# EAGLE design DCC zDecoder (EAGLE 9.6.2)
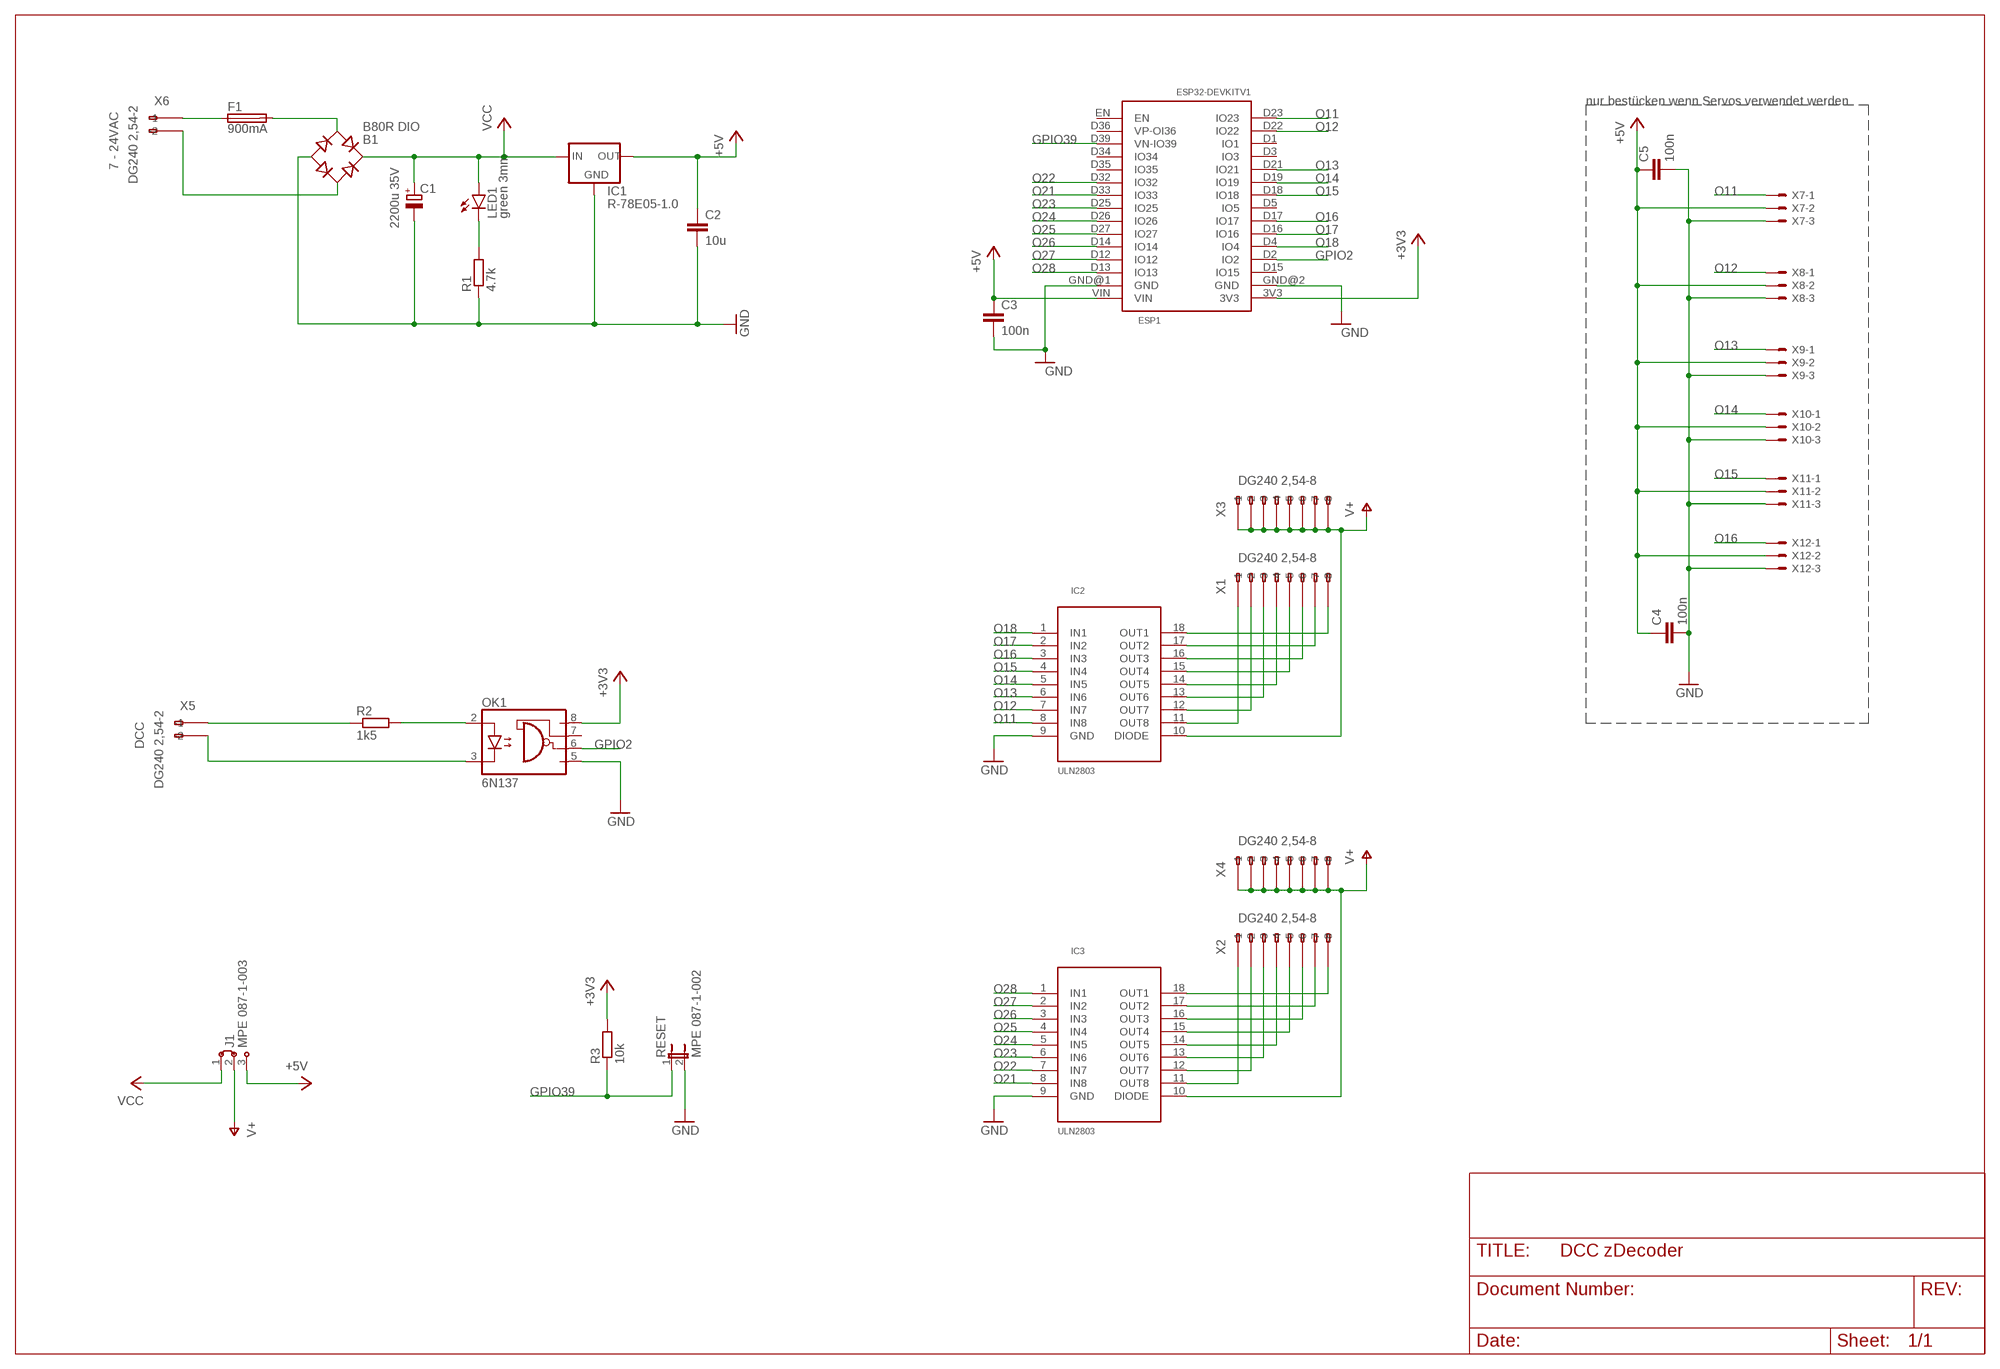
[diagram p0: schematic, sheet 1]

## Parts
B1  B80R DIO  RB1A  [RB1A]
C1  2200u 35V  CPOL-EUE5-8.5  [E5-8,5]
C2  10u  C-EU050-024X044  [C050-024X044]
C3  100n  C-EU050-024X044  [C050-024X044]
C4  100n  C-EU050-024X044  [C050-024X044]
C5  100n  C-EU050-024X044  [C050-024X044]
ESP1  ESP32DEVKITV1  [ESP32-DEVKITV1]
F1  900mA  TE5  [TE5]
IC1  R-78E05-1.0  R-78E-XX1.0  [R-78E-XX1.0]
IC2  ULN2803  ULN2803DIL18  [DIL18]
IC3  ULN2803  ULN2803DIL18  [DIL18]
J1  MPE 087-1-003  J2X2MM  [04C]
LED1  green 3mm  TLLG4400  [LED3MM]
OK1  6N137  [DIL08]
R1  4.7k  R-EU_0207/10  [0207/10]
R2  1k5  R-EU_0207/10  [0207/10]
R3  10k  R-EU_0207/10  [0207/10]
RESET  MPE 087-1-002  JP1E  [JP1]
X1  DG240 2,54-8  233-508  [233-508]
X2  DG240 2,54-8  233-508  [233-508]
X3  DG240 2,54-8  233-508  [233-508]
X4  DG240 2,54-8  233-508  [233-508]
X5  DG240 2,54-2  233-202  [233-202]
X6  DG240 2,54-2  233-202  [233-202]
X7  PSS 254/3G  22-23-2031  [22-23-2031]
X8  PSS 254/3G  22-23-2031  [22-23-2031]
X9  PSS 254/3G  22-23-2031  [22-23-2031]
X10  PSS 254/3G  22-23-2031  [22-23-2031]
X11  PSS 254/3G  22-23-2031  [22-23-2031]
X12  PSS 254/3G  22-23-2031  [22-23-2031]

## Nets
+3V3: ESP1.3V3 OK1.8(VCC) R3.2
+5V: C2.1 C3.1 C4.1 C5.1 ESP1.VIN IC1.OUT J1.3 X7.2 X8.2 X9.2 X10.2 X11.2 X12.2
GND: B1.- C1.- C2.2 C3.2 C4.2 C5.2 ESP1.GND@1(GND) ESP1.GND@2(GND) IC1.GND IC2.9(GND) IC3.9(GND) OK1.5(GND) R1.1 RESET.2 X7.3 X8.3 X9.3 X10.3 X11.3 X12.3
GPIO2: ESP1.D2(IO2) OK1.6(VO)
GPIO39: ESP1.D39(VN-IO39) R3.1 RESET.1
N$1: IC2.11(OUT8) X1.A1(-1)
N$2: IC2.12(OUT7) X1.A2(-2)
N$3: LED1.K(C) R1.2
N$4: IC2.13(OUT6) X1.A3(-3)
N$5: B1.AC1 F1.2
N$6: B1.AC2 X6.A2(-2)
N$7: IC2.14(OUT5) X1.A4(-4)
N$8: IC2.15(OUT4) X1.A5(-5)
N$9: R2.1 X5.A1(-1)
N$10: OK1.2(A) R2.2
N$11: OK1.3(C) X5.A2(-2)
N$12: IC2.16(OUT3) X1.A6(-6)
N$13: IC2.17(OUT2) X1.A7(-7)
N$14: IC2.18(OUT1) X1.A8(-8)
N$15: F1.1 X6.A1(-1)
N$16: IC3.18(OUT1) X2.A8(-8)
N$17: IC3.17(OUT2) X2.A7(-7)
N$18: IC3.16(OUT3) X2.A6(-6)
N$19: IC3.15(OUT4) X2.A5(-5)
N$20: IC3.14(OUT5) X2.A4(-4)
N$21: IC3.13(OUT6) X2.A3(-3)
N$22: IC3.12(OUT7) X2.A2(-2)
N$23: IC3.11(OUT8) X2.A1(-1)
O11: ESP1.D23(IO23) IC2.8(IN8) X7.1
O12: ESP1.D22(IO22) IC2.7(IN7) X8.1
O13: ESP1.D21(IO21) IC2.6(IN6) X9.1
O14: ESP1.D19(IO19) IC2.5(IN5) X10.1
O15: ESP1.D18(IO18) IC2.4(IN4) X11.1
O16: ESP1.D17(IO17) IC2.3(IN3) X12.1
O17: ESP1.D16(IO16) IC2.2(IN2)
O18: ESP1.D4(IO4) IC2.1(IN1)
O21: ESP1.D33(IO33) IC3.8(IN8)
O22: ESP1.D32(IO32) IC3.7(IN7)
O23: ESP1.D25(IO25) IC3.6(IN6)
O24: ESP1.D26(IO26) IC3.5(IN5)
O25: ESP1.D27(IO27) IC3.4(IN4)
O26: ESP1.D14(IO14) IC3.3(IN3)
O27: ESP1.D12(IO12) IC3.2(IN2)
O28: ESP1.D13(IO13) IC3.1(IN1)
V+: IC2.10(DIODE) IC3.10(DIODE) J1.2 X3.A1(-1) X3.A2(-2) X3.A3(-3) X3.A4(-4) X3.A5(-5) X3.A6(-6) X3.A7(-7) X3.A8(-8) X4.A1(-1) X4.A2(-2) X4.A3(-3) X4.A4(-4) X4.A5(-5) X4.A6(-6) X4.A7(-7) X4.A8(-8)
VCC: B1.+ C1.+ IC1.IN J1.1 LED1.A
Unconnected: ESP1.D1(IO1) ESP1.D3(IO3) ESP1.D5(IO5) ESP1.D15(IO15) ESP1.D34(IO34) ESP1.D35(IO35) ESP1.D36(VP-OI36) ESP1.EN OK1.7(VE) X1.B1(B-1) X1.B2(B-2) X1.B3(B-3) X1.B4(B-4) X1.B5(B-5) X1.B6(B-6) X1.B7(B-7) X1.B8(B-8) X2.B1(B-1) X2.B2(B-2) X2.B3(B-3) X2.B4(B-4) X2.B5(B-5) X2.B6(B-6) X2.B7(B-7) X2.B8(B-8) X3.B1(B-1) X3.B2(B-2) X3.B3(B-3) X3.B4(B-4) X3.B5(B-5) X3.B6(B-6) X3.B7(B-7) X3.B8(B-8) X4.B1(B-1) X4.B2(B-2) X4.B3(B-3) X4.B4(B-4) X4.B5(B-5) X4.B6(B-6) X4.B7(B-7) X4.B8(B-8) X5.B1(B-1) X5.B2(B-2) X6.B1(B-1) X6.B2(B-2)

## Notes on the sheet
- nur bestücken wenn Servos verwendet werden
- 7 - 24VAC
- DCC

## Library data of the parts
B1 = rectifier:RB1A: RECTIFIER 1 A
C1 = rcl:CPOL-EU: POLARIZED CAPACITOR, European symbol; SPICEPREFIX: C
C2-C5 = rcl:C-EU: CAPACITOR, European symbol; SPICEPREFIX: C
ESP1 = _esp32:ESP32DEVKITV1
F1 = fuse:TE5: FUSE Wickmann; OC_FARNELL: unknown; OC_NEWARK: unknown
IC1 = _eigene:R-78E-XX1.0: VOLTAGE REGULATOR
IC2 IC3 = _eigene:ULN2803
J1 = jumper:J2: Jumper switch 2 x 2.5 mm
LED1 = led:TLLG4400: Low Current (2mA) LED 3 mm Tinted Diffused Package color GREEN Source: Data sheet <http://www.farnell.com/datasheets/391098.pdf>; MF: VISHAY SEMICONDUCTOR; OC_FARNELL: 1612435
OK1 = optocoupler:6N137: MOTOROLA OPTO COUPLER; MPN: 6N137; OC_FARNELL: 1328376; OC_NEWARK: 52M1895
R1-R3 = rcl:R-EU_: RESISTOR, European symbol; SPICEPREFIX: R
RESET = jumper:JP1E: JUMPER
X1-X4 = con-wago255:233-508: WAGO; MF: Wago Corporation; MPN: 0233-0508; OC_FARNELL: 1777101; OC_NEWARK: 79K2053
X5 X6 = con-wago255:233-202: WAGO; MPN: 233-202; OC_FARNELL: 1283532; OC_NEWARK: 28K9059
X7-X12 = con-molex:22-23-2031: .100" (2.54mm) Center Header - 3 Pin; MF: MOLEX; MPN: 22-23-2031; OC_FARNELL: 1462950; OC_NEWARK: 30C0862

## Board
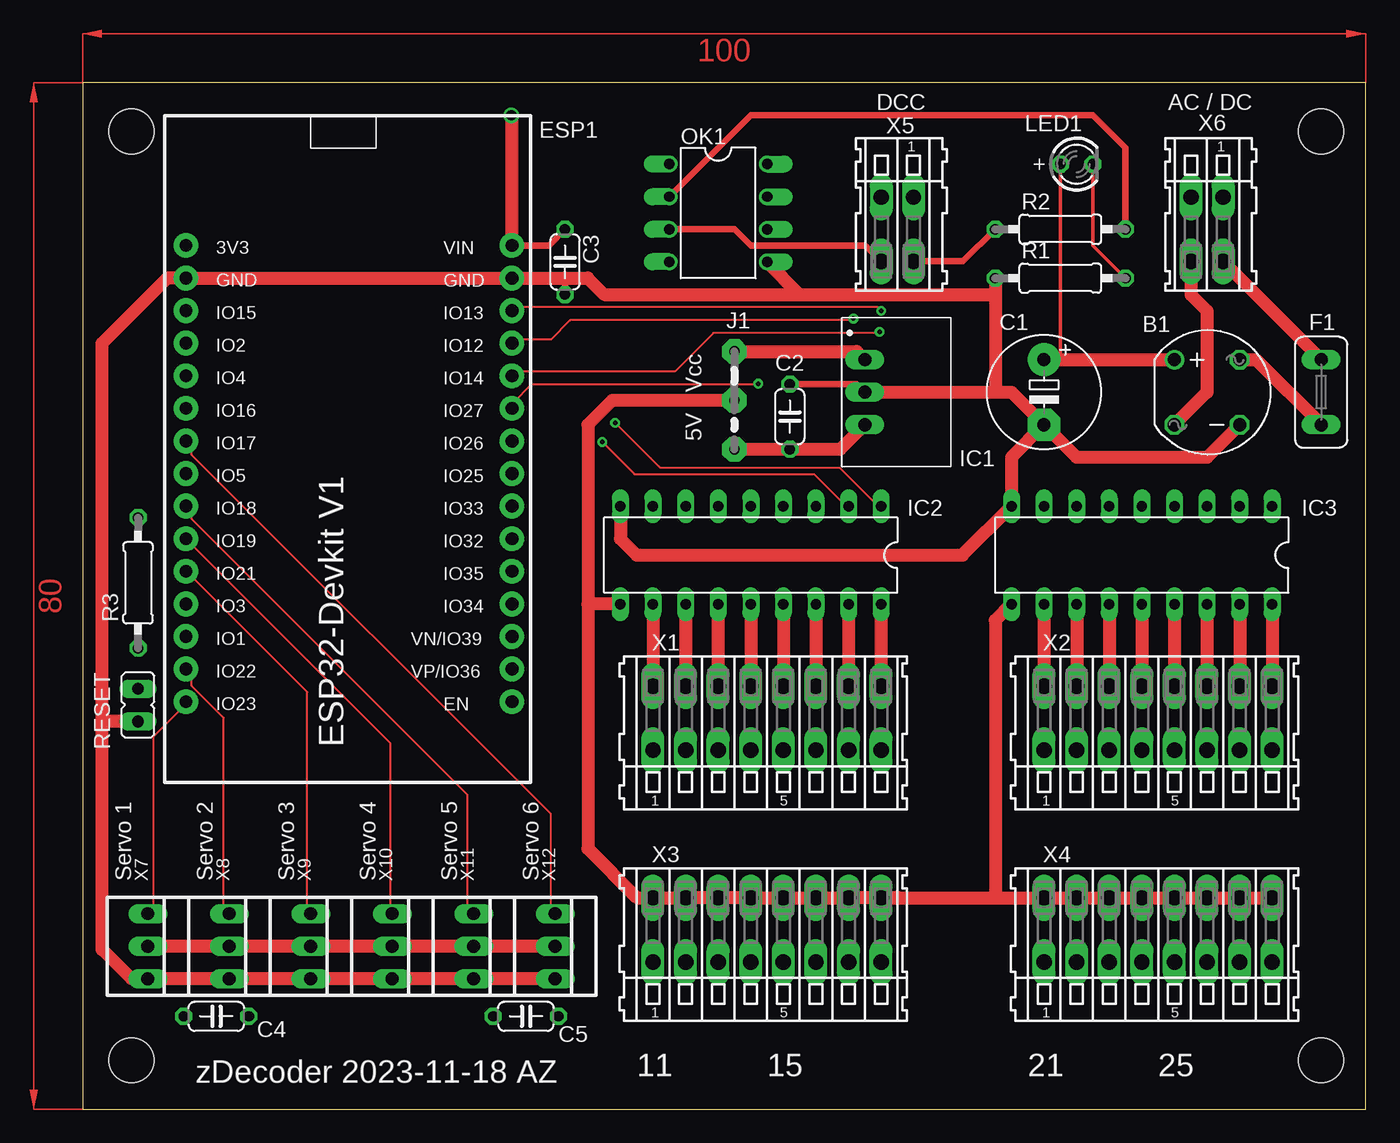
[diagram p1: board, top side]
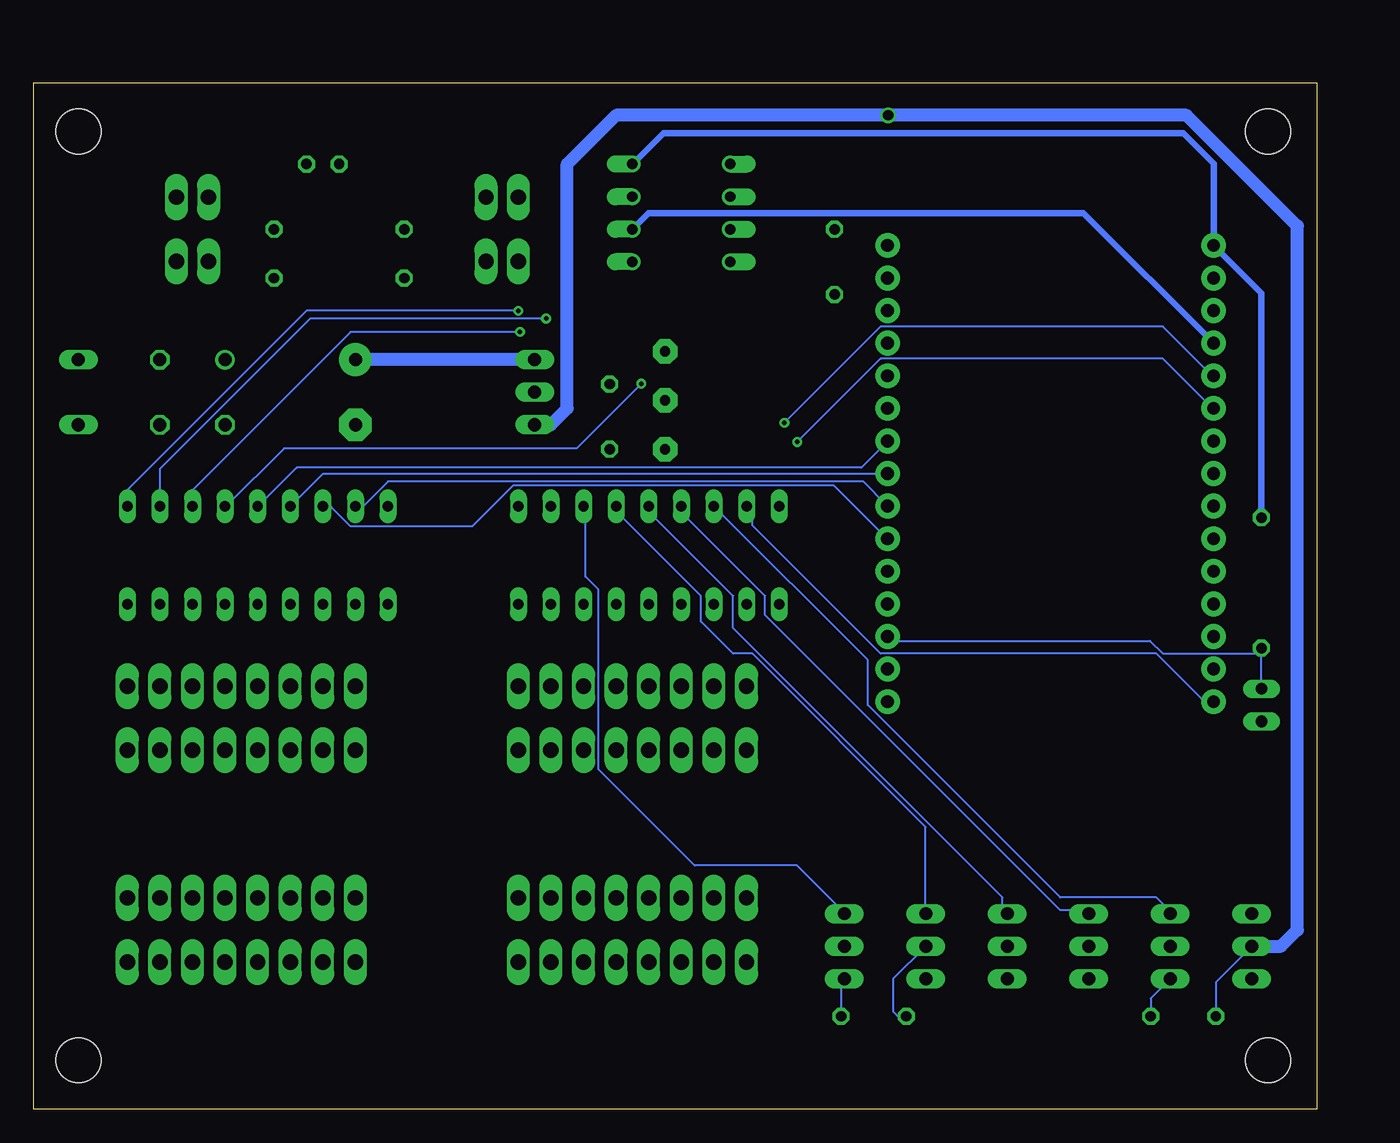
[diagram p2: board, bottom side, seen from below]

Size 100 x 80 mm. Coordinates in mm from the lower left corner, seen from the top.
Outline: 0,0 100,0 100,80 0,80 0,0
Copper layers (1*16): Top 0.035mm / dielectric 1.5mm / Bottom 0.035mm
Design rules "default": minimum track width 6mil, minimum drill 0.35mm, track to track 6mil, track to pad 6mil, pad to pad 6mil, via to via 6mil, smd to smd 6mil, copper to edge 40mil, drill to drill 6mil, minimum pad ring 10mil, minimum via ring 8mil, stop-mask expansion 4mil, vias tented up to drill 0mil, thermal gap 10mil
Holes 3.5 mm at 3.81,76.2 3.81,3.81 96.52,3.81 96.52,76.2

### Footprints (pad centres in the part's own frame; a part is rotated, then mirrored left to right if it is on the bottom)
RB1A = drill 1.016: + -2.54,2.54 | drill 1.016 octagon: - 2.54,-2.54; AC1 2.54,2.54; AC2 -2.54,-2.54
E5-8,5 = drill 1.016 pad 2.54: + -2.54,0 | drill 1.016 pad 2.54 octagon: - 2.54,0
C050-024X044 = drill 0.813 octagon: 1 -2.54,0; 2 2.54,0
ESP32-DEVKITV1 = drill 1 pad 1.93: 3V3 -16.52,-12.27; D1 13.96,-12.27; D2 -8.9,-12.27; D3 11.42,-12.27; D4 -6.36,-12.27; D5 1.26,-12.27; D12 -8.9,13.135; D13 -11.44,13.135; D14 -6.36,13.135; D15 -11.44,-12.27; D16 -3.82,-12.27; D17 -1.28,-12.27; D18 3.8,-12.27; D19 6.34,-12.27; D21 8.88,-12.27; D22 16.5,-12.27; D23 19.04,-12.27; D25 1.26,13.135; D26 -1.28,13.135; D27 -3.82,13.135; D32 6.34,13.135; D33 3.8,13.135; D34 11.42,13.135; D35 8.88,13.135; D36 16.5,13.135; D39 13.96,13.135; EN 19.04,13.135; GND@1 -13.98,13.135; GND@2 -13.98,-12.27; VIN -16.52,13.135
TE5 = drill 1.016 long: 1 -2.54,0; 2 2.54,0
R-78E-XX1.0 = drill 1.016 long: GND 0,-2.54; IN -2.54,-2.54; OUT 2.54,-2.54
DIL18 = drill 0.813 long: 1 -10.16,-3.81; 2 -7.62,-3.81; 3 -5.08,-3.81; 4 -2.54,-3.81; 5 0,-3.81; 6 2.54,-3.81; 7 5.08,-3.81; 8 7.62,-3.81; 9 10.16,-3.81; 10 10.16,3.81; 11 7.62,3.81; 12 5.08,3.81; 13 2.54,3.81; 14 0,3.81; 15 -2.54,3.81; 16 -5.08,3.81; 17 -7.62,3.81; 18 -10.16,3.81
04C = drill 0.813 pad 1.905 octagon: 1 -1.905,0; 2 1.905,0; 3 5.715,0
LED3MM = drill 0.813 octagon: A -1.27,0; K 1.27,0
DIL08 = drill 0.813 offset: 1 -3.81,-3.81; 2 -1.27,-3.81; 3 1.27,-3.81; 4 3.81,-3.81; 5 3.81,3.81; 6 1.27,3.81; 7 -1.27,3.81; 8 -3.81,3.81
0207/10 = drill 0.813 octagon: 1 -5.08,0; 2 5.08,0
JP1 = drill 0.914 long: 1 0,-1.27; 2 0,1.27
233-508 = drill 1.2 long: A1 -8.89,2.5; A2 -6.35,2.5; A3 -3.81,2.5; A4 -1.27,2.5; A5 1.27,2.5; A6 3.81,2.5; A7 6.35,2.5; A8 8.89,2.5; B1 -8.89,-2.5; B2 -6.35,-2.5; B3 -3.81,-2.5; B4 -1.27,-2.5; B5 1.27,-2.5; B6 3.81,-2.5; B7 6.35,-2.5; B8 8.89,-2.5
233-202 = drill 1.2 long: A1 -1.25,2.5; A2 1.25,2.5; B1 -1.25,-2.5; B2 1.25,-2.5
22-23-2031 = drill 1 long: 1 -2.54,0; 2 0,0; 3 2.54,0

### Placement (x,y rotation side)
B1  87.63,55.88 0 top
C1  74.93,55.88 270 top
C2  55.12,53.98 90 top
C3  37.59,66.04 270 top
C4  10.41,7.24 0 top
C5  34.54,7.24 0 top
ESP1  20.32,50.8 270 top
F1  96.52,55.88 270 top
IC1  63.5,55.88 270 top
IC2  52.07,43.18 180 top
IC3  82.55,43.18 180 top
J1  50.8,57.15 270 top
LED1  77.47,73.66 0 top
OK1  49.53,69.85 270 top
R1  76.2,64.77 0 top
R2  76.2,68.58 0 top
R3  4.32,41.02 90 top
RESET  4.32,31.5 180 top
X1  53.34,30.48 0 top
X2  83.82,30.48 0 top
X3  53.34,13.97 0 top
X4  83.82,13.97 0 top
X5  63.5,68.58 180 top
X6  87.63,68.58 180 top
X7  5.08,12.7 270 top
X8  11.43,12.7 270 top
X9  17.78,12.7 270 top
X10  24.13,12.7 270 top
X11  30.48,12.7 270 top
X12  36.83,12.7 270 top

### Tracks (layer width: path | path; a pad name or v marks a point on that pad's centre or on a via)
+3V3
  Bottom 0.508: OK1.8 50.93,76.07 10.41,76.07 8.05,73.71 ESP1.3V3 4.32,63.59 R3.2
+5V  (via drill 0.8)
  Top 0.508: ESP1.VIN 36.33,67.32 C3.1
  Top 1.016: IC1.OUT 59.05,51.44 C2.1 J1.3 | X12.2 X11.2 X10.2 X9.2 X8.2 X7.2 | ESP1.VIN 33.45,77.42 v33.4,77.47
  Bottom 0.152: X7.2 7.87,9.91 C4.1 | X11.2 33.02,10.16 33.02,7.62 32.64,7.24 C5.1
  Bottom 1.016: X7.2 2.79,12.7 1.52,13.97 1.52,68.83 10.16,77.47 v33.4,77.47 54.61,77.47 58.42,73.66 58.42,54.61 59.69,53.34 IC1.OUT
GND
  Top 0.508: C3.2 37.59,64.78 | C2.2 60.33,56.52 IC1.GND
  Top 1.016: B1.- 87.63,50.8 77.47,50.8 C1.- | C1.- 72.39,50.8 IC3.9 68.58,43.18 43.18,43.18 41.91,44.45 IC2.9 | X12.3 X11.3 X10.3 X9.3 X8.3 X7.3 3.81,10.16 1.52,12.45 1.52,30.48 | OK1.5 55.88,63.5 | IC1.GND 71.12,55.88 | 71.12,55.88 72.39,55.88 C1.- | 1.52,30.48 1.52,59.69 6.6,64.77 ESP1.GND@2 ESP1.GND@1 37.59,64.78 39.36,64.78 40.64,63.5 55.88,63.5 | RESET.2 1.78,30.23 1.52,30.48 | R1.1 71.12,63.5 | 71.12,63.5 71.12,55.88 | 55.88,63.5 71.12,63.5
  Bottom 0.152: X8.3 12.95,8.64 C4.2 | X12.3 37.08,9.91 C5.2
GPIO2
  Bottom 0.508: OK1.6 52.07,69.85 18.2,69.85 ESP1.D2
GPIO39
  Bottom 0.152: RESET.1 R3.1 4.5,35.5 12,35.5 13,36.5 33,36.5 ESP1.D39
N$1
  Top 1.016: IC2.11 X1.A1
N$2
  Top 1.016: IC2.12 X1.A2
N$3
  Top 0.254: R1.2 78.74,67.31 LED1.K
N$4
  Top 1.016: IC2.13 X1.A3
N$5
  Top 1.016: B1.AC1 91.44,58.42 F1.2
N$6
  Top 1.016: X6.A2 86.38,63.48 87.63,62.23 87.63,55.88 B1.AC2
N$7
  Top 1.016: IC2.14 X1.A4
N$8
  Top 1.016: IC2.15 X1.A5
N$9
  Top 0.508: X5.A1 68.62,66.08 R2.1
N$10
  Top 0.508: OK1.2 52.07,77.47 78.74,77.47 81.28,74.93 R2.2
N$11
  Top 0.152: 62.23,66.08 X5.A2
  Top 0.508: OK1.3 50.8,68.58 52.07,67.31 61,67.31 62.23,66.08
N$12
  Top 1.016: IC2.16 X1.A6
N$13
  Top 1.016: IC2.17 X1.A7
N$14
  Top 1.016: IC2.18 X1.A8
N$15
  Top 1.016: F1.1 88.88,66.06 X6.A1
N$16
  Top 1.016: IC3.18 X2.A8
N$17
  Top 1.016: IC3.17 X2.A7
N$18
  Top 1.016: IC3.16 X2.A6
N$19
  Top 1.016: IC3.15 X2.A5
N$20
  Top 1.016: IC3.14 X2.A4
N$21
  Top 1.016: IC3.13 X2.A3
N$22
  Top 1.016: IC3.12 X2.A2
N$23
  Top 1.016: IC3.11 X2.A1
O11
  Top 0.152: X7.1 5.5,15.5 5.5,29 8,31.5 ESP1.D23
  Bottom 0.152: IC2.8 44,46.5 44,45.5 34,35.5 12.5,35.5 8.5,31.5 ESP1.D23
O12
  Top 0.152: ESP1.D22 8.5,34 8.5,33 11,30.5 11,15.5 X8.1
  Bottom 0.152: IC2.7 35,35 35,31.5 20,16.5 12.5,16.5 11.5,15.5 X8.1
O13
  Top 0.152: ESP1.D21 8.5,41.5 17.5,32.5 17.5,15.5 X9.1
  Bottom 0.152: IC2.6 49.5,46.5 43,40 43,38.5 20,15.5 18,15.5 X9.1
O14
  Top 0.152: ESP1.D19 8.5,44 24,28.5 24,15.5 X10.1
  Bottom 0.152: IC2.5 52,46.5 45.5,40 45.5,37.5 24.5,16.5 24.5,15.5 X10.1
O15
  Top 0.152: ESP1.D18 8.5,47 8.5,46 30,24.5 30,15.5 X11.1
  Bottom 0.152: IC2.4 54.5,46.5 48,40 48,38 45.5,35.5 44,35.5 30.5,22 30.5,15.5 X11.1
O16
  Top 0.152: ESP1.D17 8.5,52 8.5,51 36.5,23 36.5,15.5 X12.1
  Bottom 0.152: IC2.3 57,46.5 57,41.5 56,40.5 56,26.5 48.5,19 40.5,19 37,15.5 X12.1
O17  (via drill 0.35)
  Top 0.152: v40.5,52 43,49.5 57,49.5 59.5,47 IC2.2
  Bottom 0.152: v40.5,52 34,58.5 12,58.5 8.5,55 ESP1.D16
O18  (via drill 0.35)
  Top 0.152: v41.5,53.5 45,50 59,50 62,47 IC2.1
  Bottom 0.152: v41.5,53.5 34,61 12,61 8.5,57.5 ESP1.D4
O21
  Bottom 0.152: IC3.8 74.83,47.09 74.22,47.09 72.39,48.92 35.36,48.92 33.53,47.09 ESP1.D33
O22
  Bottom 0.152: IC3.7 77.42,46.94 76.81,46.94 75.29,45.41 65.84,45.41 62.64,48.62 37.64,48.62 33.53,44.5 ESP1.D32
O23
  Bottom 0.152: IC3.6 77.5,49.5 33.5,49.5 ESP1.D25
O24
  Bottom 0.152: IC3.5 82.5,47 79.5,50 35.5,50 33.5,52 ESP1.D26
O25  (via drill 0.35)
  Top 0.152: v52.64,56.55 52.59,56.5 35,56.5 33.5,55 ESP1.D27
  Bottom 0.152: v52.64,56.55 57.69,51.5 80.5,51.5 85,47 IC3.4
O26  (via drill 0.35)
  Top 0.152: ESP1.D14 33.5,57.5 46.15,57.5 49.15,60.5 62,60.5 v62.1,60.58
  Bottom 0.152: v62.1,60.58 75.31,60.58 87.63,48.26 IC3.3
O27  (via drill 0.35)
  Top 0.152: ESP1.D12 33.5,60 36.5,60 38,61.5 60,61.5 v60.07,61.62
  Bottom 0.152: v60.07,61.62 78.46,61.62 90.17,49.91 IC3.2
O28  (via drill 0.35)
  Top 0.152: ESP1.D13 33.5,62.5 62,62.5 v62.23,62.23
  Bottom 0.152: v62.23,62.23 78.74,62.23 92.71,48.26 IC3.1
V+
  Top 1.016: 71.12,16.47 X3.A8 63.46,16.47 63.5,16.51 59.73,16.51 X3.A7 X3.A6 X3.A5 X3.A4 X3.A3 X3.A2 X3.A1 43.22,16.47 39.37,20.32 39.37,39.37 | 71.12,16.47 X4.A1 X4.A2 X4.A3 X4.A4 X4.A5 X4.A6 X4.A7 X4.A8 | IC3.10 71.12,38.1 71.12,16.47 | J1.2 41.27,55.24 39.37,53.34 39.37,39.37 | IC2.10 39.37,39.37
VCC
  Top 0.254: 76.2,58.42 LED1.A
  Top 1.016: J1.1 60.33,59.05 IC1.IN | C1.+ 76.2,58.42 B1.+
  Bottom 1.016: IC1.IN C1.+
(copper drawn outside any net)
  shapes: Top area x2

### Text on the board
tNames: DCC | AC / DC | + | Vcc | 5V | Servo 1 | Servo 2 | Servo 3 | Servo 4 | Servo 5 | Servo 6 | 11 | 15 | 21 | 25 | zDecoder 2023-11-18 AZ